# EAGLE design N-P-MOSFET_adapter (EAGLE 8.3.2)
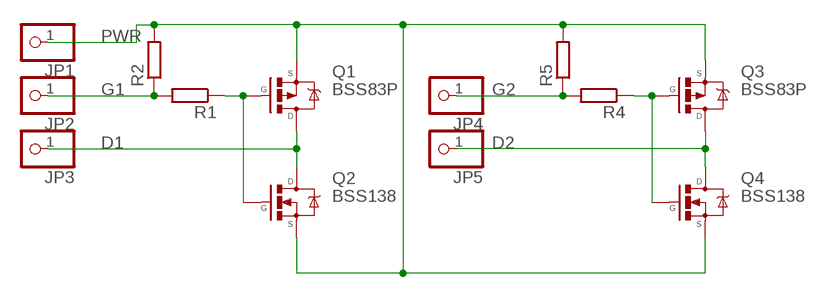
[diagram p0: schematic, sheet 1]

## Parts
JP1  PINHD-1X1JUST_PIN  [1X01_BARE]
JP2  PINHD-1X1JUST_PIN  [1X01_BARE]
JP3  PINHD-1X1JUST_PIN  [1X01_BARE]
JP4  PINHD-1X1JUST_PIN  [1X01_BARE]
JP5  PINHD-1X1JUST_PIN  [1X01_BARE]
Q1  BSS83P  [SOT23]
Q2  BSS138  [SOT23]
Q3  BSS83P  [SOT23]
Q4  BSS138  [SOT23]
R1  R-EU_R0805  [R0805]
R2  R-EU_R0805  [R0805]
R4  R-EU_R0805  [R0805]
R5  R-EU_R0805  [R0805]

## Nets
D1: JP3.1 Q1.3(D) Q2.3(D)
D2: JP5.1 Q3.3(D) Q4.3(D)
G1: JP2.1 R1.2 R2.1
G2: JP4.1 R4.2 R5.1
N$3: Q1.1(G) Q2.1(G) R1.1
N$4: Q3.1(G) Q4.1(G) R4.1
PWR: JP1.1 Q1.2(S) Q2.2(S) Q3.2(S) Q4.2(S) R2.2 R5.2

## Library data of the parts
JP1-JP5 = my-pinhead:PINHD-1X1: PIN HEADER
Q1 Q3 = my-mosfet:BSS83P: P-Channel Enhancement Mode Transistor
Q2 Q4 = my-mosfet:BSS138: N-Channel Enhancement Mode Transistor
R1 R2 R4 R5 = rcl:R-EU_: RESISTOR, European symbol

## Board
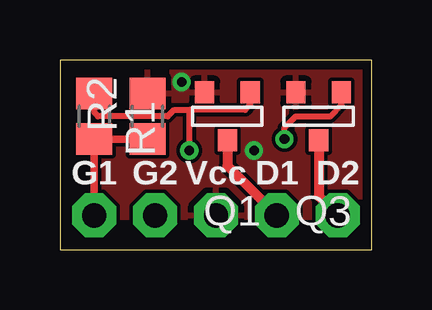
[diagram p1: board, top side]
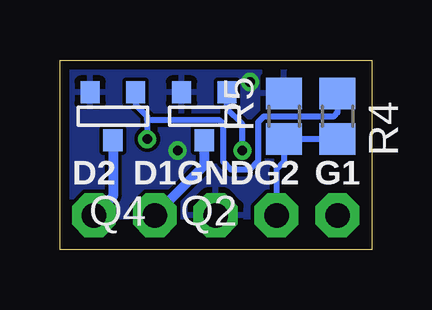
[diagram p2: board, bottom side, seen from below]

Size 13.01 x 7.9 mm. Coordinates in mm from the lower left corner, seen from the top.
Outline: 0,0 13.01,0 13.01,7.9 0,7.9 0,0
Copper layers (1*16): Top 0.0356mm / dielectric 1.5011mm / Bottom 0.0356mm
Design rules "PCBs_io *": minimum track width 6mil, minimum drill 13mil, track to track 6mil, track to pad 6mil, pad to pad 6mil, via to via 6mil, smd to smd 6mil, copper to edge 15mil, drill to drill 6mil, minimum pad ring 16mil, minimum via ring 7mil, stop-mask expansion 3mil, vias tented up to drill 0.6mm, thermal gap 10mil

### Footprints (pad centres in the part's own frame; a part is rotated, then mirrored left to right if it is on the bottom)
1X01_BARE = drill 1.016 octagon: 1 0,0
SOT23 = smd 0.8 x 0.9: 1 -0.95,-1; 2 0.95,-1; 3 0,1
R0805 = smd 1.3 x 1.5: 1 -0.95,0; 2 0.95,0

### Placement (x,y rotation side)
JP1  6.51,1.43 0 bottom
JP2  1.43,1.43 0 bottom
JP3  9.05,1.43 0 bottom
JP4  3.97,1.43 0 bottom
JP5  11.59,1.43 0 bottom
Q1  6.99,5.56 180 top
Q2  6.99,5.56 180 bottom
Q3  10.79,5.56 180 top
Q4  10.79,5.56 180 bottom
R1  1.43,5.56 270 top
R2  3.65,5.56 90 top
R4  1.43,5.56 270 bottom
R5  3.65,5.56 90 bottom

### Tracks (layer width: path | path; a pad name or v marks a point on that pad's centre or on a via)
D1
  Top 0.406: Q2.3 6.99,3.49 JP3.1
  Bottom 0.406: Q2.3 6.99,3.49 JP3.1
D2
  Top 0.406: Q3.3 10.79,2.22 JP5.1
  Bottom 0.406: Q3.3 10.79,2.22 JP5.1
G1
  Top 0.305: JP2.1 R1.2 R2.1
G2
  Bottom 0.254: JP4.1 3.97,3.33 3.65,3.65 R5.1 R4.2
N$1
  cutout Top: 0.16,1.11 10.79,1.11 13.02,1.11 13.02,0 0,0 0,1.11
N$2
  cutout Bottom: 0.16,1.11 13.02,1.11 13.02,0 0,0 0,1.11
N$3  (via drill 0.4)
  Top 0.254: R1.1 1.43,5.71 1.59,5.56 4.5,5.56 4.77,5.83 5.4,5.83 | v5.4,4.13 5.4,5.83 | 5.4,5.83 7.73,5.83 7.93,6.03 Q1.1
  Bottom 0.254: v5.4,4.13 5.4,5.24 6.03,5.87 Q2.1
N$4  (via drill 0.4)
  Top 0.254: Q3.1 11.75,6.03 11.27,5.56 9.84,5.56 9.37,5.08 v9.37,4.6
  Bottom 0.254: Q4.1 9.85,6.04 9.37,5.56 9.37,5.4 | 9.37,5.4 v9.37,4.6 | R4.1 1.43,5.71 1.59,5.56 4.5,5.56 4.74,5.31 4.74,3.67 5.08,3.33 5.87,3.33 6.19,3.65 6.19,5.24 6.35,5.4 9.37,5.4
N$5
  cutout Top: 1.75,5.87 3.02,5.87 3.02,7.3 1.75,7.3
  cutout Bottom: 3.02,5.87 1.75,5.87 1.75,7.3 3.02,7.3
PWR  (via drill 0.4)
  other vias: 8.1,4.13 5.08,6.99
  pour Top: 0,7.78 0,0 13.02,0 13.02,7.78
  pour Bottom: 0,7.78 0,0 13.02,0 13.02,7.78

### Text on the board
tPlace: G1 | G2 | Vcc | D1 | D2
bPlace: G1 | G2 | GND | D1 | D2